# Altium schematic sheet power.SchDoc
size A4
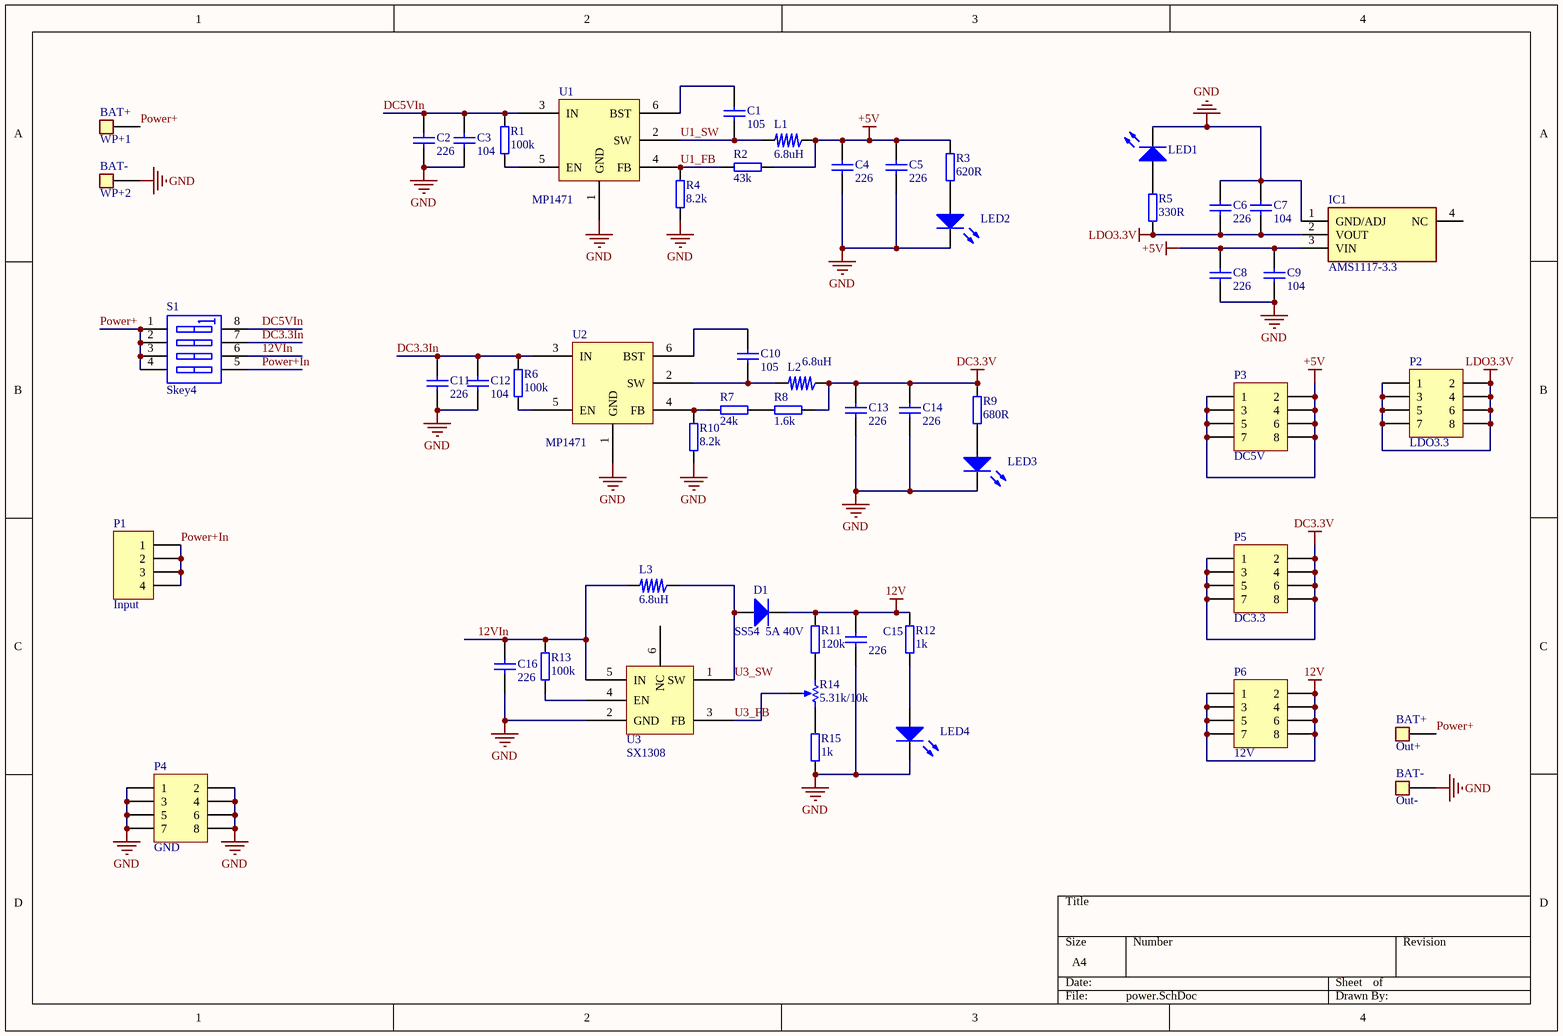
[diagram p0: power.SchDoc]

## Parts
C1  105  [CAPC1608[0603]]
C2  226  [CAPC1608[0603]]
C3  104  [CAPC1608[0603]]
C4  226  [CAPC1608[0603]]
C5  226  [CAPC1608[0603]]
C6  226  [CAPC1608[0603]]
C7  104  [CAPC1608[0603]]
C8  226  [CAPC1608[0603]]
C9  104  [CAPC1608[0603]]
C10  105  [CAPC1608[0603]]
C11  226  [CAPC1608[0603]]
C12  104  [CAPC1608[0603]]
C13  226  [CAPC1608[0603]]
C14  226  [CAPC1608[0603]]
C15  226  [CAPC1608[0603]]
C16  226  [CAPC1608[0603]]
D1  SS54  5A 40V  [SMA[DO-214AC]]
IC1  AMS1117-3.3  [SOT229P700X180-4N]
L1  6.8uH  [WHC0420]
L2  6.8uH  [WHC0420]
L3  6.8uH  [WHC0420]
LED1  Red  [LEDC1608(0603)]  (value not drawn)
LED2  Red  [LEDC1608(0603)]  (value not drawn)
LED3  Red  [LEDC1608(0603)]  (value not drawn)
LED4  Red  [LEDC1608(0603)]  (value not drawn)
Out+  BAT+  [WirePadSingleSide]  (no BOM)
Out-  BAT-  [WirePadSingleSide]  (no BOM)
P1  Input  [HDR1X4]
P2  LDO3.3  [HDR2X4]
P3  DC5V  [HDR2X4]
P4  GND  [HDR2X4]
P5  DC3.3  [HDR2X4]
P6  12V  [HDR2X4]
R1  100k  [RESC1608[0603]]
R2  43k  [RESC1608[0603]]
R3  620R  [RESC1608[0603]]
R4  8.2k  [RESC1608[0603]]
R5  330R  [RESC1608[0603]]
R6  100k  [RESC1608[0603]]
R7  24k  [RESC1608[0603]]
R8  1.6k  [RESC1608[0603]]
R9  680R  [RESC1608[0603]]
R10  8.2k  [RESC1608[0603]]
R11  120k  [RESC1608[0603]]
R12  1k  [RESC1608[0603]]
R13  100k  [RESC1608[0603]]
R14  5.31k/10k  [Rhostat2]
R15  1k  [RESC1608[0603]]
S1  Skey4  [Skey4]
U1  MP1471  [TSOT23-6]
U2  MP1471  [TSOT23-6]
U3  SX1308  [SOT23-6]
WP+1  BAT+  [WirePadSingleSide]  (no BOM)
WP+2  BAT-  [WirePadSingleSide]  (no BOM)

## Nets
12V: C15.1 D1.K P6.1 P6.2 P6.3 P6.4 P6.5 P6.6 P6.7 P6.8 R11.2 R12.2
+5V: C4.1 C5.1 C8.1 C9.1 IC1.3(VIN) L1.1 P3.1 P3.2 P3.3 P3.4 P3.5 P3.6 P3.7 P3.8 R2.2 R3.2
DC3.3V: C13.1 C14.1 L2.1 P5.1 P5.2 P5.3 P5.4 P5.5 P5.6 P5.7 P5.8 R8.2 R9.2
GND: C2.2 C3.2 C4.2 C5.2 C6.1 C7.1 C8.2 C9.2 C11.2 C12.2 C13.2 C14.2 C15.2 C16.2 IC1.1(GND/ADJ) LED1.C LED2.C LED3.C LED4.C Out-.1 P4.1 P4.2 P4.3 P4.4 P4.5 P4.6 P4.7 P4.8 R4.2 R10.2 R15.1 U1.1(GND) U2.1(GND) U3.2(GND) WP+2.1
LDO3.3V: C6.2 C7.2 IC1.2(VOUT) P2.1 P2.2 P2.3 P2.4 P2.5 P2.6 P2.7 P2.8 R5.1
12VIn: C16.1 L3.2 R13.1 S1.6(B3) U3.5(IN)
DC3.3In: C11.1 C12.1 R6.1 S1.7(B2) U2.3(IN)
DC5VIn: C2.1 C3.1 R1.1 S1.8(B1) U1.3(IN)
Power+: Out+.1 S1.1(A1) S1.2(A2) S1.3(A3) S1.4(A4) WP+1.1
Power+In: P1.1 P1.2 P1.3 P1.4 S1.5(B4)
U1_FB: R2.1 R4.1 U1.4(FB)
U1_SW: C1.2 L1.2 U1.2(SW)
U3_FB: R14.3(TAP) U3.3(FB)
U3_SW: D1.A L3.1 U3.1(SW)
NetC1_1: C1.1 U1.6(BST)
NetC10_1: C10.1 U2.6(BST)
NetC10_2: C10.2 L2.2 U2.2(SW)
NetLED1_A: LED1.A R5.2
NetLED2_A: LED2.A R3.1
NetLED3_A: LED3.A R9.1
NetLED4_A: LED4.A R12.1
NetR1_2: R1.2 U1.5(EN)
NetR6_2: R6.2 U2.5(EN)
NetR7_1: R7.1 R10.1 U2.4(FB)
NetR7_2: R7.2 R8.1
NetR11_1: R11.1 R14.1(TOP)
NetR13_2: R13.2 U3.4(EN)
NetR14_2: R14.2(BOT) R15.2

Not connected (* = marked no-connect by the designer): IC1 4(NC); U3 6(NC)

## Library data of the parts
C1-C16 = Cap Chip 1: Chip Capacitor, PSpice Model; Tolerance: Y5V; Voltage: 3V; Published: 8-Jun-2000; Revision: July-2002: Re-released for DXP Platform.; Publisher: Altium Limited; Price(RMB): 0.000
  C1 C10: Value: 105
  C2 C4-C6 C8 C11 C13-C16: Value: 226
  C3 C7 C9 C12: Value: 104
D1 = Diode SMx: Molded Diode; Imax: 500mA; Voltage: 5A40V; Published: 8-Jun-2000; Revision: July-2002: Re-released for DXP Platform.; Publisher: Altium Limited; Price(RMB): 0.000; PartNumber: SS54  5A 40V
IC1 = AMS1117-3.3: Integrated Circuit; Manufacturer_Name: Advanced; Datasheet Link: https://datasheet.datasheetarchive.com/originals/distributors/Datasheets-28/DSA-550594.pdf; Height: 1.8mm; Manufacturer_Part_Number: AMS1117-3.3
L1-L3 = L: Value: 22uH
LED1-LED4 = LED Chip: Typical Chip LED; Published: 8-Jun-2000; Revision: July-2002: Re-released for DXP Platform.; Publisher: Altium Limited; Price(RMB): 0.00; Color: Red
Out+ Out- WP+1 WP+2 = Wire Pad: Wire soldering pad.; Price(RMB): 0.000
P1 = Header 4: Header, 4-Pin; LatestRevisionDate: 17-Jul-2002; LatestRevisionNote: Re-released for DXP Platform.; Publisher: Altium Limited; Price(RMB): 0.00
P2-P6 = Header 4X2: Header, 4-Pin, Dual row; LatestRevisionDate: 17-Jul-2002; LatestRevisionNote: Re-released for DXP Platform.; Publisher: Altium Limited; Price(RMB): 0.00
R1-R13 R15 = Res Chip 2p 1: Chip Resistor, PSpice Model, IPC PCB Library Drawing; Tolerance: 5%; TC1: 0; Published: 8-Jun-2000; Revision: July-2002: Re-released for DXP Platform.; Publisher: Altium Limited; Price(RMB): 0.000; TC2: 0
  R1 R6 R13: Value: 100k
  R2: Value: 43k
  R3: Value: 620R
  R4 R10: Value: 8.2k
  R5: Value: 330R
  R7: Value: 24k
  R8: Value: 1.6k
  R9: Value: 680R
  R11: Value: 120k
  R12 R15: Value: 1k
R14 = Rhostat
U1 U2 = MP1471: 4.7v-16V Input / 16V3A / 500K
U3 = SX1308: boost / 1.2MHz / 2V-24V input / up to 28V Output